# Altium schematic sheet Power_2.SchDoc
size A4; SheetNumber: 2; SheetTotal: 8
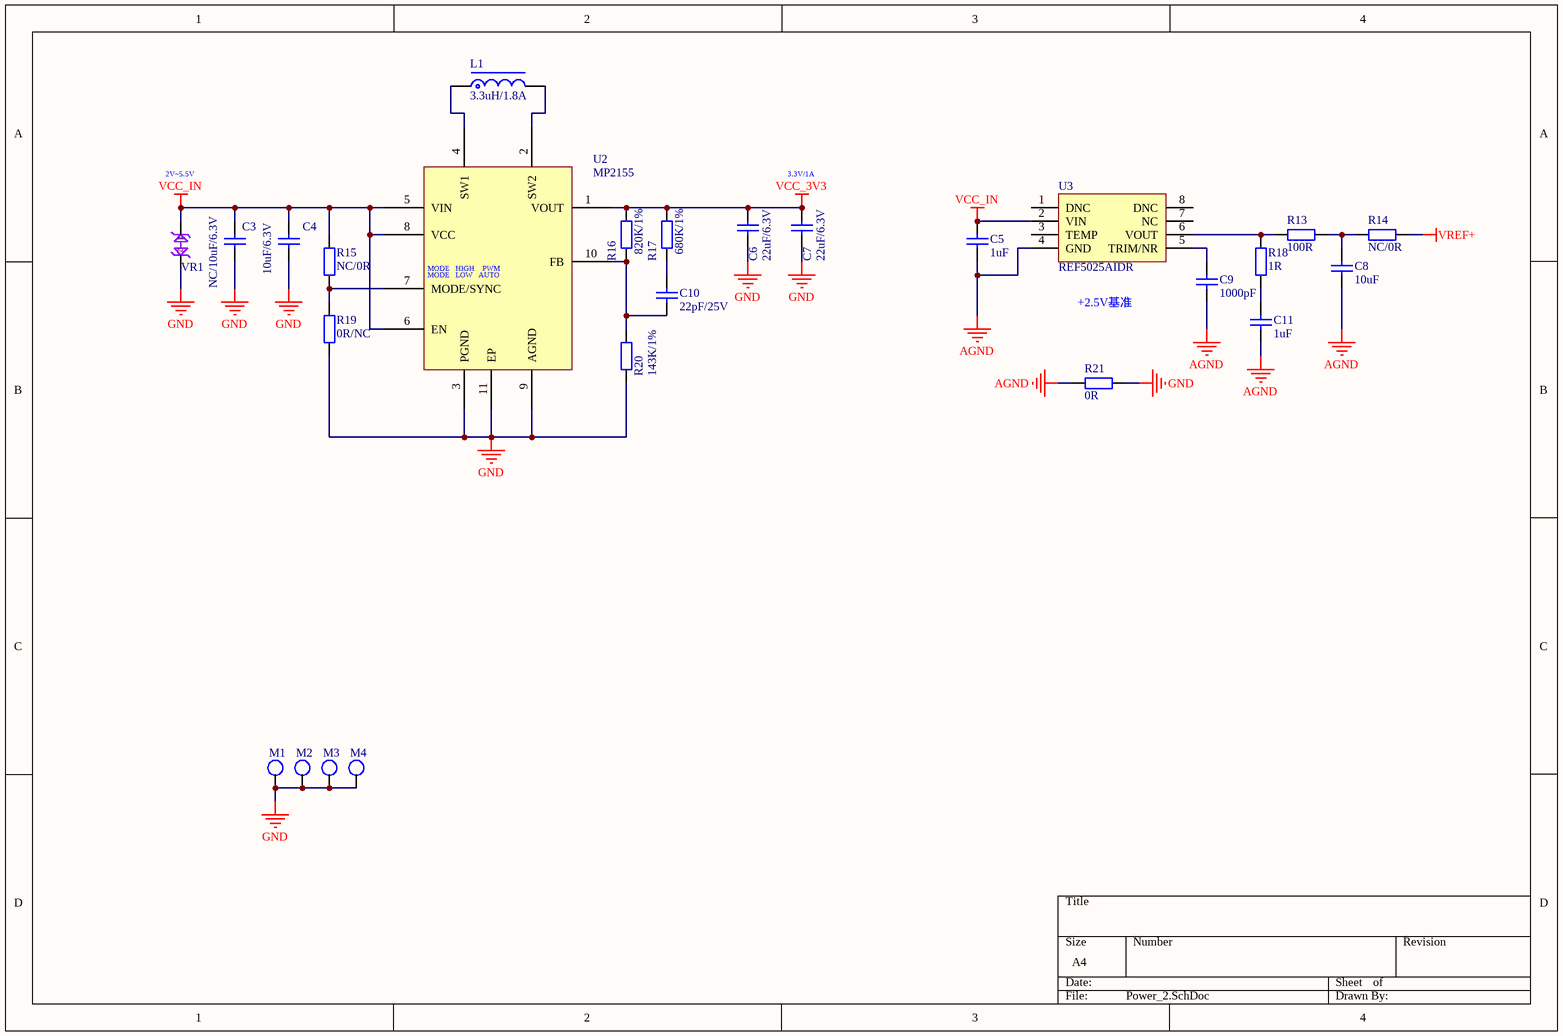
[diagram p0: Power_2.SchDoc]

## Parts
C3  NC/10uF/6.3V  [C0603_L]
C4  10uF/6.3V  [C0603_L]
C5  1uF  [C0402_L]
C6  22uF/6.3V  [C0603_L]
C7  22uF/6.3V  [C0603_L]
C8  10uF  [C0603_L]
C9  1000pF  [C0402_L]
C10  22pF/25V  [C0402_L]
C11  1uF  [C0402_L]
L1  3.3uH/1.8A  [NR2520]
M1  M2  [M2]  (value not drawn)
M2  M2  [M2]  (value not drawn)
M3  M2  [M2]  (value not drawn)
M4  M2  [M2]  (value not drawn)
R13  100R  [R0402_L]
R14  NC/0R  [R0402_L]
R15  NC/0R  [R0402_L]
R16  820K/1%  [R0402_L]
R17  680K/1%  [R0402_L]
R18  1R  [R0402_L]
R19  0R/NC  [R0402_L]
R20  143K/1%  [R0402_L]
R21  0R  [R0402_L]
U2  MP2155  [QFN10(3mmX3mm)]
U3  REF5025AIDR  [SOIC-8L]
VR1  UAD8C05L01  [SOD882]  (value not drawn)

## Nets
AGND: C5.1 C8.1 C9.1 C11.1 R21.1 U3.4(GND)
GND: C3.1 C4.1 C6.1 C7.1 M1.1 M2.1 M3.1 M4.1 R19.1 R20.1 R21.2 U2.3(PGND) U2.9(AGND) U2.11(EP) VR1.2
VCC_3V3: C6.2 C7.2 R16.2 R17.2 U2.1(VOUT)
VCC_IN: C3.2 C4.2 C5.2 R15.2 U2.5(VIN) U2.6(EN) U2.8(VCC) U3.2(VIN) VR1.1
VREF+: R14.2
NetC8_2: C8.2 R13.2 R14.1
NetC9_2: C9.2 U3.5(TRIM/NR)
NetC10_1: C10.1 R16.1 R20.2 U2.10(FB)
NetC10_2: C10.2 R17.1
NetC11_2: C11.2 R18.1
NetL1_1: L1.1 U2.4(SW1)
NetL1_2: L1.2 U2.2(SW2)
NetR13_1: R13.1 R18.2 U3.6(VOUT)
NetR15_1: R15.1 R19.2 U2.7(MODE/SYNC)

Not connected (* = marked no-connect by the designer): U3 1(DNC) 3(TEMP) 7(NC) 8(DNC)

## Notes on the sheet
- 2V~5.5V
- 3.3V/1A
- (near U2) MODE   HIGH    PWM
- (near U2) MODE   LOW   AUTO
- +2.5V基准

## Library data of the parts
C3-C11 = C: 贴片电容; BOM名称: 无极性贴片电容; 联系卖家，免费查找封装: 唯一出售店铺网址https://shop463601444.taobao.com
L1 = L-NR: 太诱-NR磁胶电感; BOM名称: NR磁胶电感; 联系卖家，免费查找封装: 唯一出售店铺网址https://shop463601444.taobao.com
M1-M4 = M2系列: M2孔支撑柱
R13-R21 = R: 贴片电阻; 联系卖家，免费查找封装: 唯一出售店铺网址https://shop463601444.taobao.com; BOM名称: 贴片电阻
U2 = MP2155: 高效、低静态电流的Buck-Boost变换器
U3 = REF5025AIDR: 3uVpp/V噪声 3ppm/℃漂移 电压基准 0.05%